# Altium schematic sheet AD8232.SchDoc
size A4
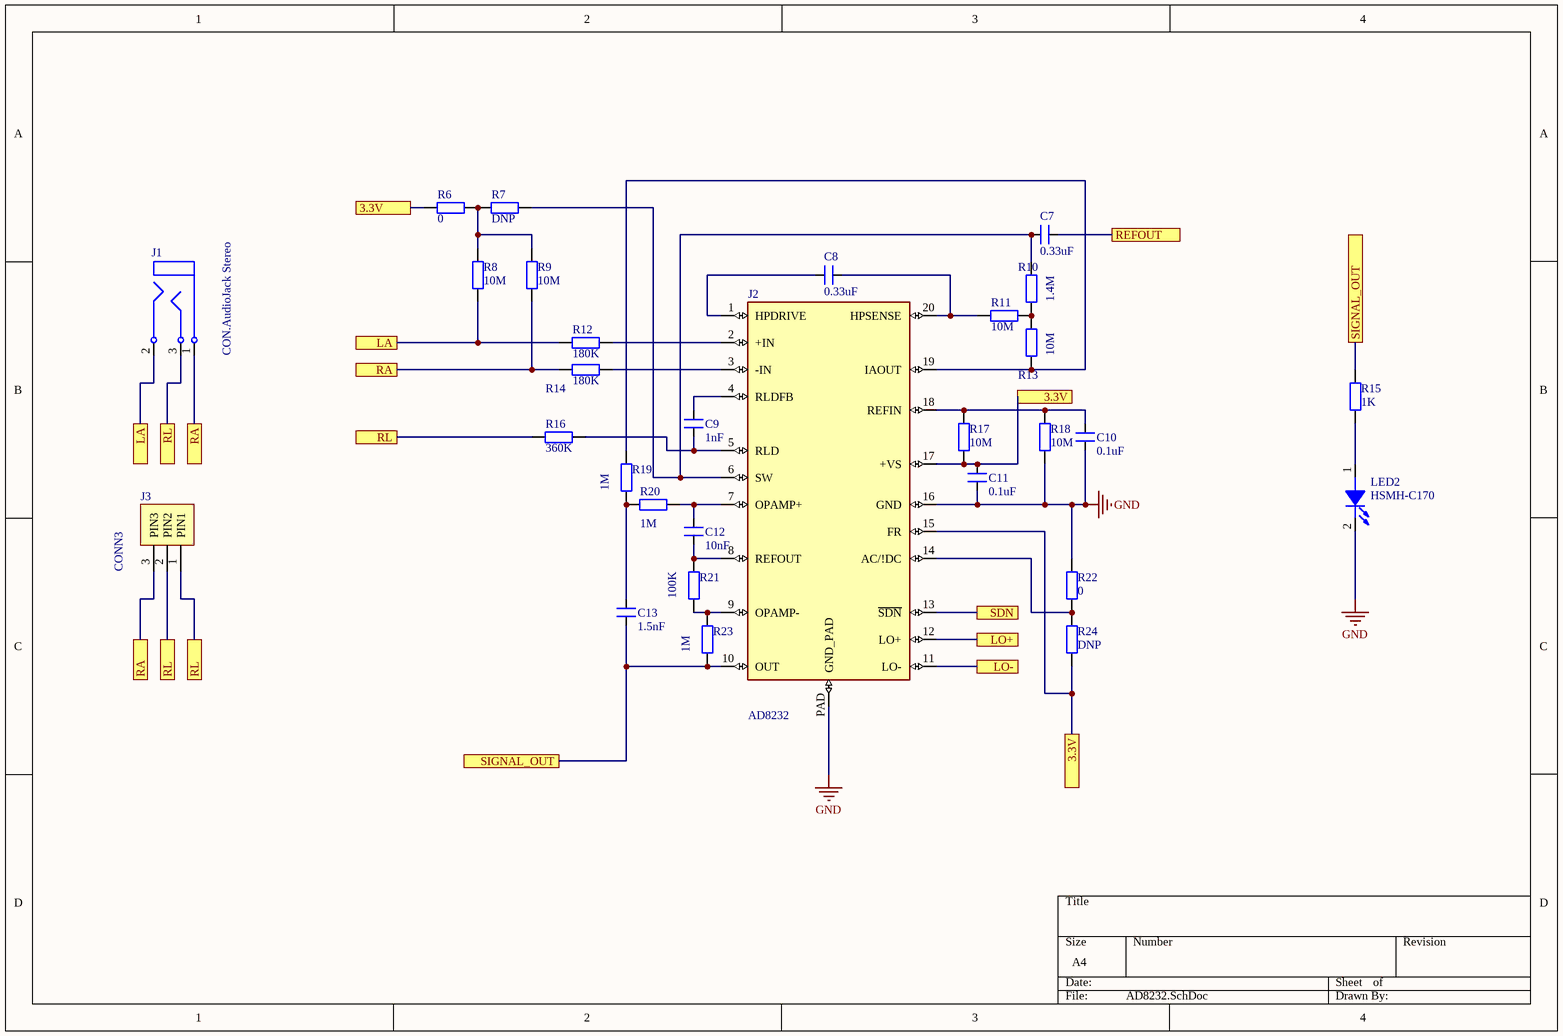
[diagram p0: AD8232.SchDoc]

## Parts
C7  0.33uF  [SM-0805]
C8  0.33uF  [SM-0805]
C9  1nF  [SM-0805]
C10  0.1uF  [SM-0805]
C11  0.1uF  [SM-0805]
C12  10nF  [SM-0805]
C13  1.5nF  [SM-0805]
J1  CON.AudioJack Stereo  [SJ-3523-SMT]
J2  AD8232  [AD8232]
J3  CONN3  [CONN3]
LED2  HSMH-C170  [LED.SMD.RED]
R6  value 0  [DIEN TRO 0805]  (hidden comment: RES_SMD_0805)
R7  value DNP  [DIEN TRO 0805]  (hidden comment: RES_SMD_0805)
R8  value 10M  [DIEN TRO 0805]  (hidden comment: RES_SMD_0805)
R9  value 10M  [DIEN TRO 0805]  (hidden comment: RES_SMD_0805)
R10  value 1.4M  [DIEN TRO 0805]  (hidden comment: RES_SMD_0805)
R11  value 10M  [DIEN TRO 0805]  (hidden comment: RES_SMD_0805)
R12  value 180K  [DIEN TRO 0805]  (hidden comment: RES_SMD_0805)
R13  value 10M  [DIEN TRO 0805]  (hidden comment: RES_SMD_0805)
R14  value 180K  [DIEN TRO 0805]  (hidden comment: RES_SMD_0805)
R15  value 1K  [DIEN TRO 0805]  (hidden comment: RES_SMD_0805)
R16  value 360K  [DIEN TRO 0805]  (hidden comment: RES_SMD_0805)
R17  value 10M  [DIEN TRO 0805]  (hidden comment: RES_SMD_0805)
R18  value 10M  [DIEN TRO 0805]  (hidden comment: RES_SMD_0805)
R19  value 1M  [DIEN TRO 0805]  (hidden comment: RES_SMD_0805)
R20  value 1M  [DIEN TRO 0805]  (hidden comment: RES_SMD_0805)
R21  value 100K  [DIEN TRO 0805]  (hidden comment: RES_SMD_0805)
R22  value 0  [DIEN TRO 0805]  (hidden comment: RES_SMD_0805)
R23  value 1M  [DIEN TRO 0805]  (hidden comment: RES_SMD_0805)
R24  value DNP  [DIEN TRO 0805]  (hidden comment: RES_SMD_0805)

## Ports
3.3V, LA, LO+, LO-, RA, REFOUT, RL, SDN, SIGNAL_OUT

## Nets
GND: C10.1 C11.1 J2.16(GND) J2.PAD(GND_PAD) LED2.2(K) R18.1 R22.2
3.3V: C11.2 J2.15(FR) J2.17(+VS) R6.1 R17.1 R24.1 ; port 3.3V
LA: J1.2 R8.1 R12.1 ; port LA
LO+: J2.12(LO+) ; port LO+
LO-: J2.11(LO-) ; port LO-
RA: J1.1 J3.3(PIN3) R9.1 R14.1 ; port RA
REFOUT: C7.2 ; port REFOUT
RL: J1.3 J3.1(PIN1) J3.2(PIN2) R16.1 ; port RL
SDN: J2.13(~{SDN}) ; port SDN
SIGNAL_OUT: C13.1 J2.10(OUT) R15.1 R23.1 ; port SIGNAL_OUT
NetC7_1: C7.1 J2.6(SW) R7.2 R10.2
NetC8_1: C8.1 J2.1(HPDRIVE)
NetC8_2: C8.2 J2.20(HPSENSE) R11.1
NetC9_1: C9.1 J2.5(RLD) R16.2
NetC9_2: C9.2 J2.4(RLDFB)
NetC10_2: C10.2 J2.18(REFIN) R17.2 R18.2
NetC12_1: C12.1 J2.8(REFOUT) R21.2
NetC12_2: C12.2 J2.7(OPAMP+) R20.2
NetC13_2: C13.2 R19.1 R20.1
NetJ2_2: J2.2(+IN) R12.2
NetJ2_3: J2.3(-IN) R14.2
NetJ2_9: J2.9(OPAMP-) R21.1 R23.2
NetJ2_14: J2.14(AC/!DC) R22.1 R24.2
NetJ2_19: J2.19(IAOUT) R13.1 R19.2
NetLED2_1: LED2.1(A) R15.2
NetR6_2: R6.2 R7.1 R8.2 R9.2
NetR10_1: R10.1 R11.2 R13.2

## Library data of the parts
C7-C13 = CM: Cap SMD; Value: 103
J1 = CON.AudioJack Stereo: AUDIO JACK 3.5MM STEREO SMD; Vendor: Digi-Key; Vendor P/N: CP-3523SJTR-ND; Published: 5-Jan-2004; DatasheetDocument: 07-Mar-2000; Publisher: Altium Limited; Mounting Type: Surface Mount, Right Angle; ComponentLink1Description: Digikey Part link; ComponentLink1URL: http://search.digikey.com/scripts/DkSearch/dksus.dll?Detail&name=CP-3523SJTR-ND; ComponentLink2Description: Open DataSheet; ComponentLink2URL: H:\LIBRARY\LIBRARY.Datasheet\
J2 = AD8232: ECG Front End 20-LFCSP-WQ (4x4); MF: Analog Devices; Price: None; Value: *; Check_prices: https://www.snapeda.com/parts/AD8232/Analog%20Devices/view-part/4218063/?ref=eda; Package: LFCSP-20 Analog Devices; SnapEDA_Link: https://www.snapeda.com/parts/AD8232/Analog%20Devices/view-part/4218063/?ref=snap; Availability: Bad; MP: AD8232
J3 = Bornera_3_pin
LED2 = LED_1: Typical GaAs SMD LED; Manufacturer: Lite-On Inc; Color: RED; Type: Cong ty RP; Vendor: Digikey; Publisher: Hoang Nguyen; Price: *; Published: 13-April-2009; ComponentLink1Description: Digikey Part Link; ComponentLink2Description: Open Datasheet; ComponentLink2URL: H:\LIBRARY\LIBRARY.Datasheet\
R6-R24 = RES_SMD_0805: RES_0805; Published: 8-Jun-2000; LatestRevisionDate: 17-Jul-2002; LatestRevisionNote: Re-released for DXP Platform.; PackageReference: AXIAL-0.4; Publisher: Altium Limited